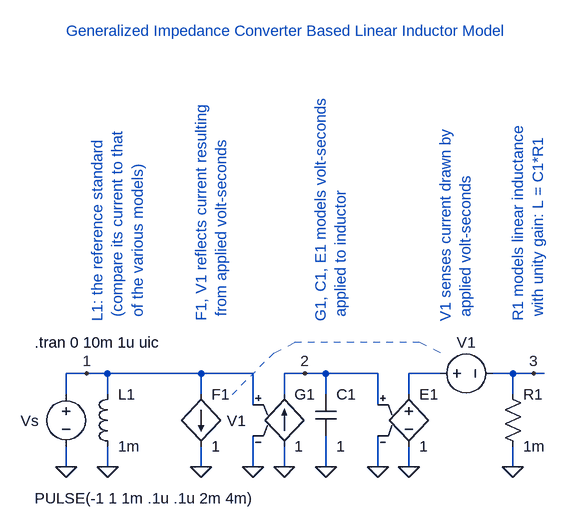
[diagram p0: schematic linear_inductor.asc]
linear_inductor.asc, the LTspice schematic file:
Version 4
SHEET 1 1044 680
WIRE -112 -80 -112 -112
WIRE -112 32 -112 0
WIRE -160 -64 -160 -112
WIRE -160 -112 -240 -112
WIRE -304 -112 -304 -80
WIRE -304 0 -304 32
WIRE -160 -16 -160 32
WIRE -240 32 -240 -16
WIRE -240 -80 -240 -112
WIRE -240 -112 -272 -112
WIRE -352 -16 -352 32
WIRE -352 -112 -432 -112
WIRE -352 -112 -352 -64
WIRE -432 -112 -576 -112
WIRE -432 32 -432 0
WIRE -432 -80 -432 -112
WIRE -640 32 -640 0
WIRE -640 -80 -640 -112
WIRE -608 -112 -640 -112
WIRE 48 -112 48 -80
WIRE 48 0 48 32
WIRE 48 -112 16 -112
WIRE -112 -112 -64 -112
WIRE 48 -112 80 -112
WIRE -272 -112 -304 -112
WIRE 80 -112 96 -112
WIRE -576 -112 -576 -80
WIRE -576 0 -576 32
WIRE -576 -112 -608 -112
FLAG -272 -112 2
FLAG -640 32 0
FLAG -608 -112 1
FLAG -304 32 0
FLAG -240 32 0
FLAG -160 32 0
FLAG -112 32 0
FLAG 48 32 0
FLAG 80 -112 3
FLAG -576 32 0
FLAG -432 32 0
FLAG -352 32 0
SYMBOL g -304 -96 R0
WINDOW 0 16 16 Left 0
WINDOW 3 16 96 Left 0
SYMATTR InstName G1
SYMATTR Value 1
SYMBOL cap -256 -80 R0
WINDOW 0 32 0 Left 0
WINDOW 3 32 80 Left 0
SYMATTR InstName C1
SYMATTR Value 1
SYMBOL e -112 -96 R0
WINDOW 0 16 16 Left 0
WINDOW 3 16 96 Left 0
SYMATTR InstName E1
SYMATTR Value 1
SYMBOL voltage -80 -112 R270
WINDOW 0 32 56 VTop 0
WINDOW 3 -32 56 Invisible 0
SYMATTR InstName V1
SYMATTR Value 0
SYMBOL f -432 -80 R0
WINDOW 0 16 0 Left 0
WINDOW 3 40 41 Left 0
WINDOW 123 16 80 Left 0
SYMATTR InstName F1
SYMATTR Value V1
SYMATTR Value2 1
SYMBOL voltage -640 -96 R0
WINDOW 123 0 0 Left 0
WINDOW 39 48 72 Left 0
WINDOW 3 -48 176 Left 0
WINDOW 0 -42 57 Right 0
SYMATTR Value PULSE(-1 1 1m .1u .1u 2m 4m)
SYMATTR InstName Vs
SYMBOL res 32 -96 R0
WINDOW 0 32 16 Left 0
WINDOW 3 32 96 Left 0
SYMATTR InstName R1
SYMATTR Value 1m
SYMBOL ind -560 -96 M0
WINDOW 0 0 16 Right 0
WINDOW 3 0 96 Right 0
SYMATTR InstName L1
SYMATTR Value 1m
TEXT -688 -160 Left 0 !.tran 0 10m 1u uic
TEXT -248 -192 VLeft 0 ;G1, C1, E1 models volt-seconds\n applied to inductor
TEXT -432 -192 VLeft 0 ;F1, V1 reflects current resulting\n from applied volt-seconds
TEXT 56 -192 VLeft 0 ;R1 models linear inductance\n with unity gain: L = C1*R1
TEXT -56 -192 VLeft 0 ;V1 senses current drawn by\n applied volt-seconds
TEXT -296 -624 Bottom 0 ;Generalized Impedance Converter Based Linear Inductor Model
TEXT -592 -192 VLeft 0 ;L1: the reference standard\n (compare its current to that\n of the various models)
LINE Normal -96 -160 -288 -160 2
LINE Normal -64 -144 -96 -160 2
LINE Normal -320 -144 -288 -160 2
LINE Normal -384 -80 -320 -144 2

The netlist it stands for:
* linear_inductor.asc
G1 0 2 1 0 1
C1 2 0 1
E1 N001 0 2 0 1
V1 N001 3 0
F1 1 0 V1 1
Vs 1 0 PULSE(-1 1 1m .1u .1u 2m 4m)
R1 3 0 1m
L1 1 0 1m
.tran 0 10m 1u uic
* G1, C1, E1 models volt-seconds
*  applied to inductor
* F1, V1 reflects current resulting
*  from applied volt-seconds
* R1 models linear inductance
*  with unity gain: L = C1*R1
* V1 senses current drawn by
*  applied volt-seconds
* Generalized Impedance Converter Based Linear Inductor Model
* L1: the reference standard
*  (compare its current to that
*  of the various models)
.backanno
.end